# EAGLE design IMU (EAGLE 9.6.2)
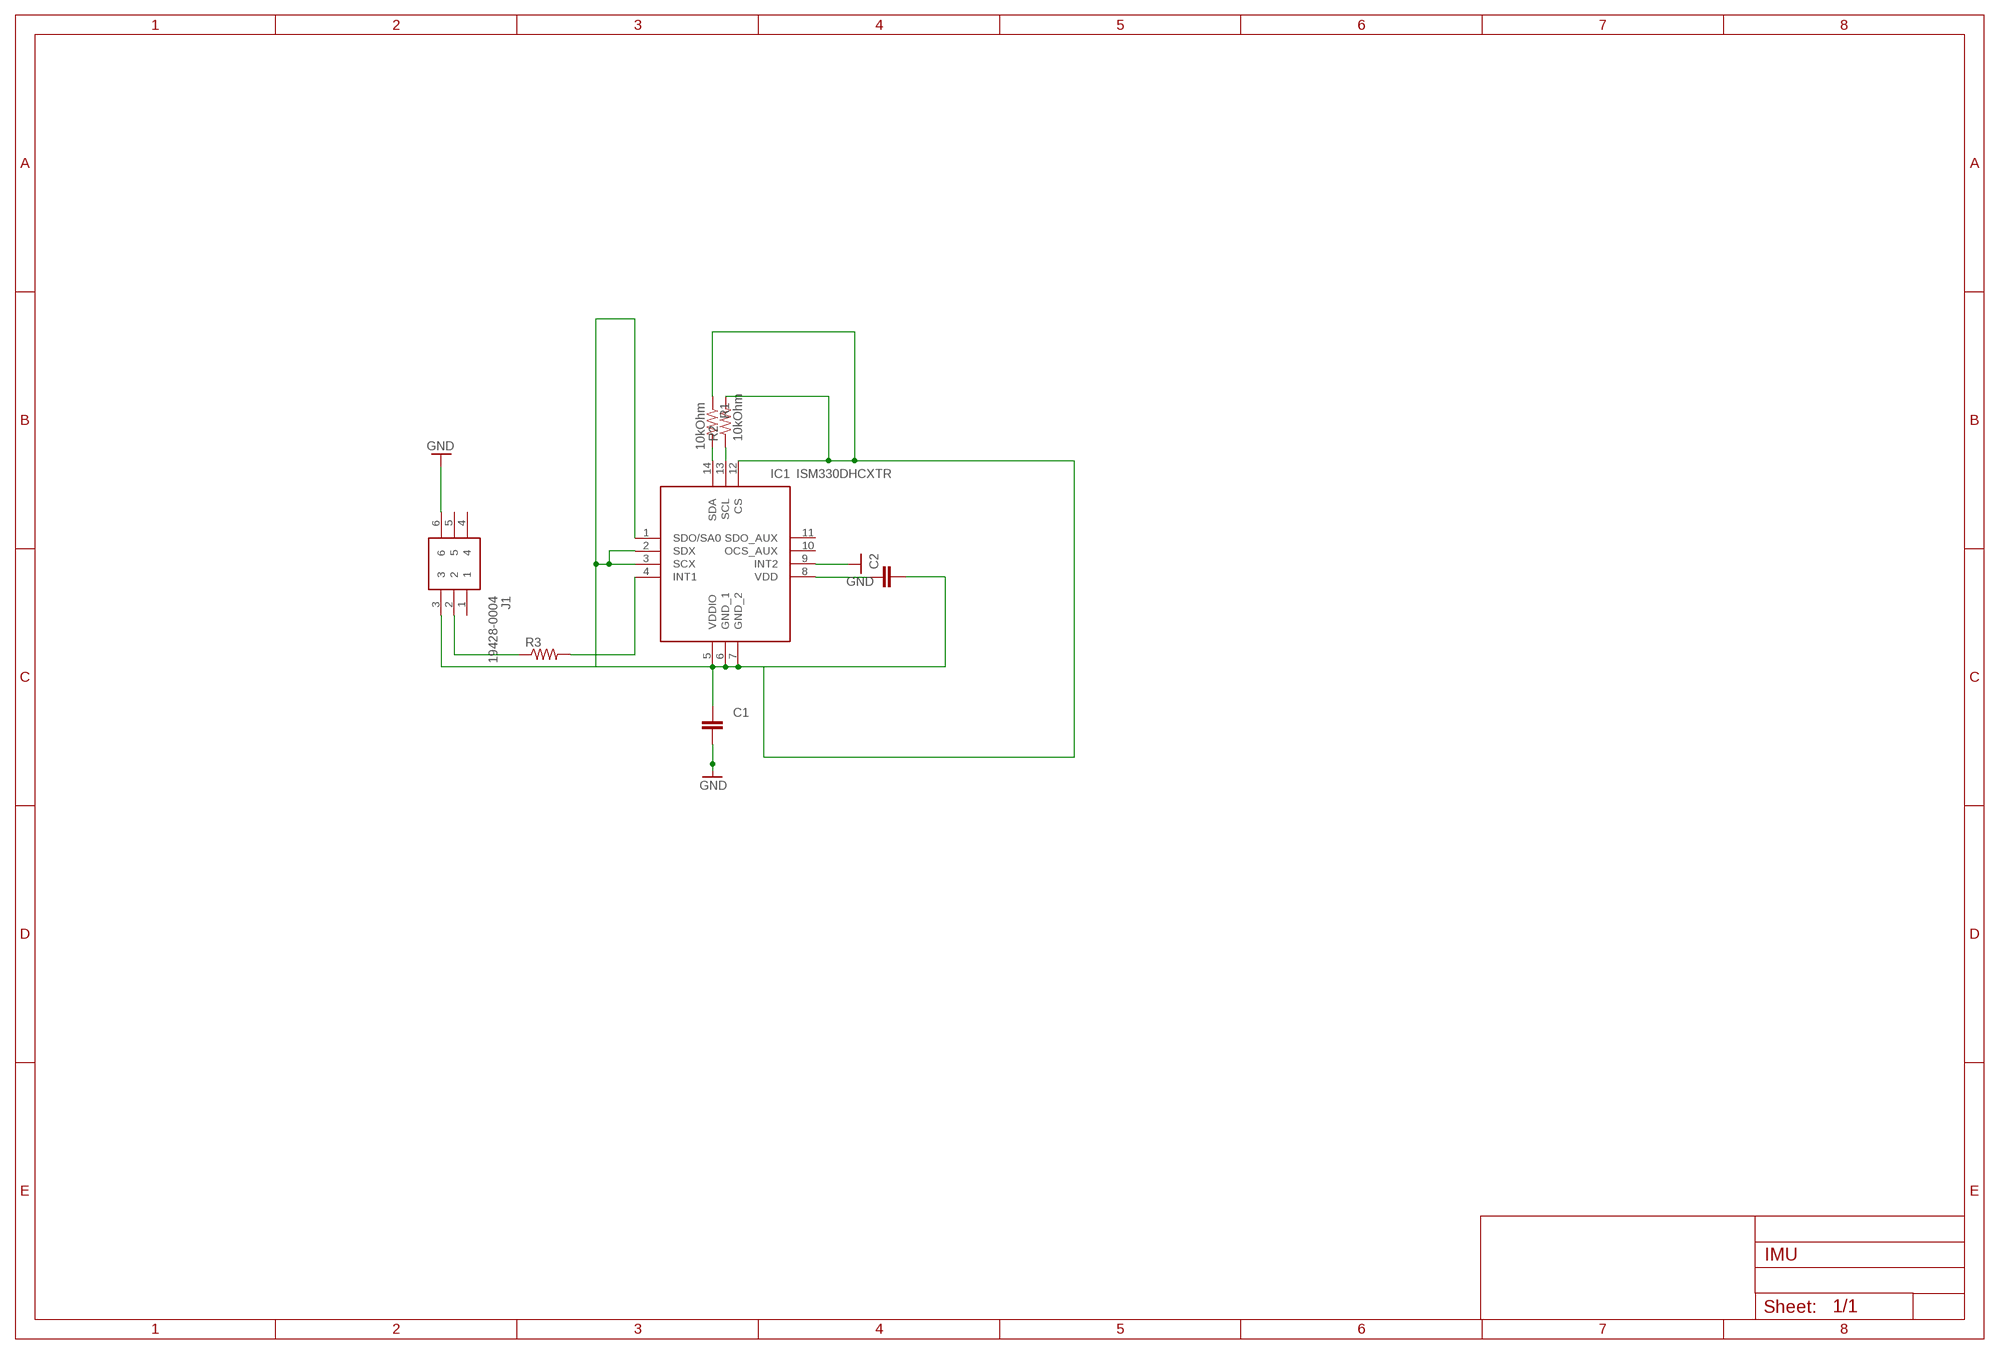
[diagram p0: schematic, sheet 1]

## Parts
C1  C-EUC0805  [C0805]
C2  C-EUC0805  [C0805]
IC1  ISM330DHCXTR  [LGA-14(2.5X3X0.86)]
J1  19428-0004  [194280004]
R1  10kOhm  R-US_0411/12  [0411/12]
R2  10kOhm  R-US_0411/12  [0411/12]
R3  R-US_R0805  [R0805]

## Nets
GND: C1.2 IC1.9(INT2) J1.6
N$1: IC1.1(SDO/SA0) IC1.2(SDX) IC1.3(SCX)
N$2: C1.1 C2.2 IC1.5(VDDIO) IC1.6(GND_1) IC1.7(GND_2) IC1.12(CS) J1.3 R1.1 R2.2
N$3: IC1.13(SCL) R2.1
N$4: C2.1 IC1.8(VDD)
N$5: IC1.14(SDA) R1.2
N$6: J1.2 R3.1
N$7: IC1.4(INT1) R3.2
Unconnected: IC1.10(OCS_AUX) IC1.11(SDO_AUX) J1.1 J1.4 J1.5

## Library data of the parts
C1 C2 = rcl:C-EU: CAPACITOR, European symbol; SPICEPREFIX: C
IC1 = ISM330DHCXTR:ISM330DHCXTR: IMUs - Inertial Measurement Units VFLGA2.5X3X.86 14L P.5 L.475X.25 Source: Datasheet <https://www.st.com/resource/en/datasheet/ism330dhcx.pdf>; ARROW_PART_NUMBER: ISM330DHCXTR; ARROW_PRICE-STOCK: https://www.arrow.com/en/products/ism330dhcxtr/stmicroelectronics; DESCRIPTION: IMUs - Inertial Measurement Units VFLGA2.5X3X.86 14L P.5 L.475X.25; HEIGHT: mm; MANUFACTURER_NAME: STMicroelectronics; MANUFACTURER_PART_NUMBER: ISM330DHCXTR; MOUSER_PART_NUMBER: 511-ISM330DHCXTR; MOUSER_PRICE-STOCK: https://www.mouser.co.uk/ProductDetail/STMicroelectronics/ISM330DHCXTR?qs=%252B6g0mu59x7Jv2Xps2dM6Xw%3D%3D
J1 = SamacSys_Parts:19428-0004: Automotive Connectors Source: Datasheet <https://componentsearchengine.com/Datasheets/1/19428-0004.pdf>; ARROW_PART_NUMBER: 19428-0004; DESCRIPTION: Automotive Connectors; HEIGHT: 40.04mm; MANUFACTURER_NAME: Molex; MANUFACTURER_PART_NUMBER: 19428-0004; MOUSER_PART_NUMBER: 538-19428-0004; MOUSER_PRICE-STOCK: https://www.mouser.co.uk/ProductDetail/Molex/19428-0004?qs=l0xbah4rxIfd5Eogy17VMg%3D%3D
R1-R3 = rcl:R-US_: RESISTOR, American symbol; SPICEPREFIX: R

## Board
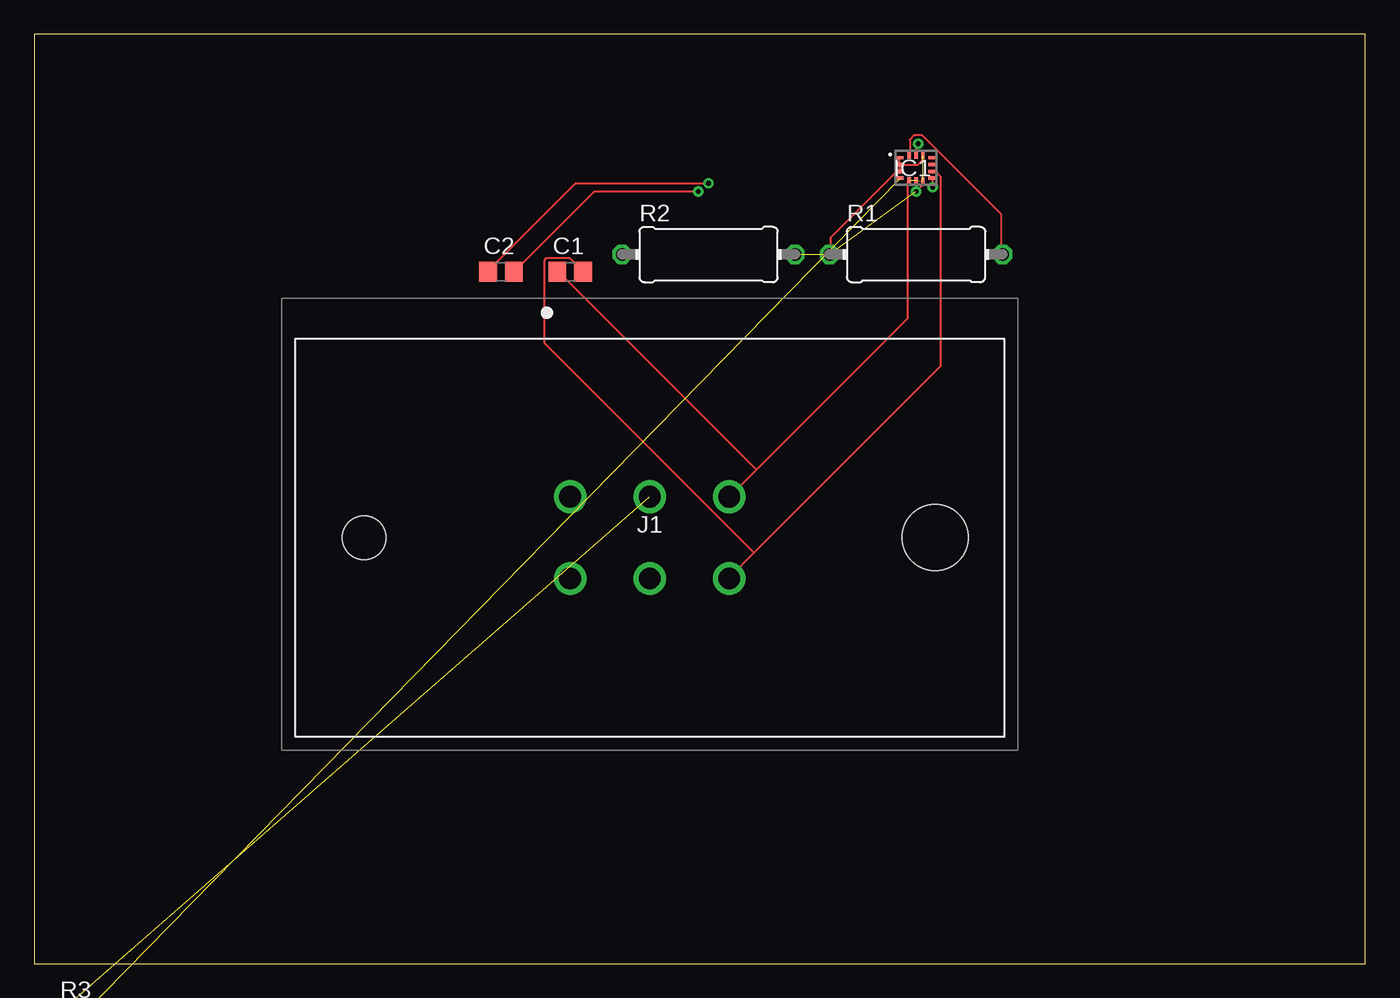
[diagram p1: board, top side]
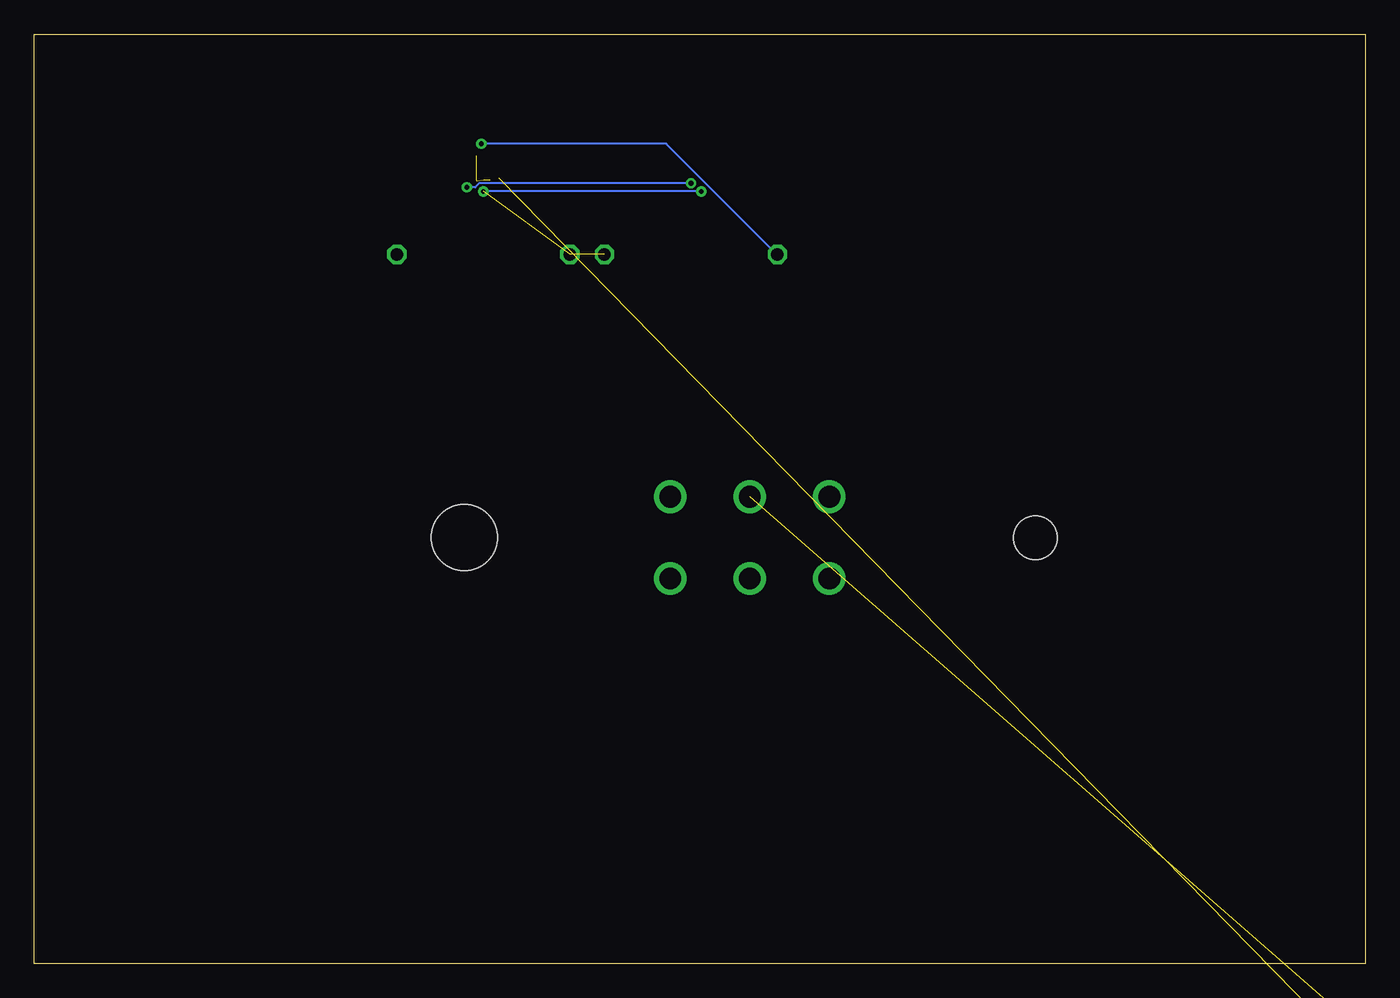
[diagram p2: board, bottom side, seen from below]

Size 97.77 x 68.25 mm. Coordinates in mm from the lower left corner, seen from the top.
Outline: 0,0 97.77,0 97.77,68.25 0,68.25 0,0
Copper layers (1*16): Top 0.035mm / dielectric 1.5mm / Bottom 0.035mm
Design rules "default": minimum track width 6mil, minimum drill 0.35mm, track to track 6mil, track to pad 6mil, pad to pad 6mil, via to via 6mil, smd to smd 6mil, copper to edge 40mil, drill to drill 6mil, minimum pad ring 10mil, minimum via ring 8mil, stop-mask expansion 4mil, vias tented up to drill 0mil, thermal gap 10mil

### Footprints (pad centres in the part's own frame; a part is rotated, then mirrored left to right if it is on the bottom)
C0805 = smd 1.3 x 1.5: 1 -0.95,0; 2 0.95,0
LGA-14(2.5X3X0.86) = smd 0.475 x 0.25: 1 -1.163,0.75; 2 -1.163,0.25; 3 -1.163,-0.25; 4 -1.163,-0.75; 8 1.163,-0.75; 9 1.163,-0.25; 10 1.163,0.25; 11 1.163,0.75 | smd 0.25 x 0.475: 5 -0.5,-0.912; 6 0,-0.912; 7 0.5,-0.912; 12 0.5,0.912; 13 0,0.912; 14 -0.5,0.912
194280004 = drill 1.6 pad 2.4: 1 0,0; 2 5.84,0; 3 11.68,0; 4 0,-6; 5 5.84,-6; 6 11.68,-6 | hole 3.2: -15.115,-3 | hole 4.86: 26.795,-3
0411/12 = drill 0.914 octagon: 1 -6.35,0; 2 6.35,0
R0805 = smd 1.3 x 1.5: 1 -0.95,0; 2 0.95,0

### Placement (x,y rotation side)
C1  39.37,50.8 0 top
C2  34.29,50.8 0 top
IC1  64.77,58.42 0 top
J1  39.37,34.29 0 top
R1  64.77,52.07 0 top
R2  49.53,52.07 0 top
R3  2.54,-3.81 0 top  (outside the outline)

### Tracks (layer width: path | path; a pad name or v marks a point on that pad's centre or on a via)
GND
  Top 0.152: 52.88,30.18 51.05,28.35 J1.6 | 52.88,30.18 66.6,43.89 66.6,57.76 66.29,58.06 65.99,58.06 IC1.9 | 52.88,30.18 37.49,45.57 37.49,51.66 37.64,51.82 39.32,51.82 40.23,50.9 C1.2
N$1
  Top 0.152: 63.55,58.67 63.55,58.22 IC1.3 63.55,58.06 63.25,58.06 58.52,53.34 58.52,52.12 | 63.55,58.67 63.55,59.13 IC1.1 | 63.55,58.67 IC1.2 63.7,58.67 64.92,58.67 65.23,58.98 65.23,59.28
N$2  (via drill 0.35)  (6 unrouted)
  Top 0.152: 65.23,57.45 65.23,57.15 v64.77,56.69 | v48.77,56.69 41.15,56.69 35.36,50.9 C2.2 | 53.03,36.27 J1.3 | 53.03,36.27 64.16,47.4 64.16,57.45 IC1.5 | 53.03,36.27 38.56,50.75 C1.1
  Bottom 0.152: v48.77,56.69 v64.77,56.69
N$3  (via drill 0.35)
  Top 0.152: IC1.13 64.77,60.05 v64.92,60.2
  Bottom 0.152: v64.92,60.2 51.36,60.2 43.28,52.12 R2.1
N$4  (via drill 0.35)
  Top 0.152: v65.99,57 65.99,57.61 IC1.8 | v49.53,57.3 39.78,57.3 33.38,50.9 C2.1
  Bottom 0.152: v65.99,57 65.38,57 65.08,57.3 v49.53,57.3
N$5
  Top 0.152: IC1.14 64.31,59.44 64.31,60.5 64.62,60.81 65.23,60.81 71.02,55.02 71.02,52.12 R1.2
N$6  (1 unrouted)
N$7  (1 unrouted)